# EAGLE design Lighting Schematic (EAGLE 8.7.0)
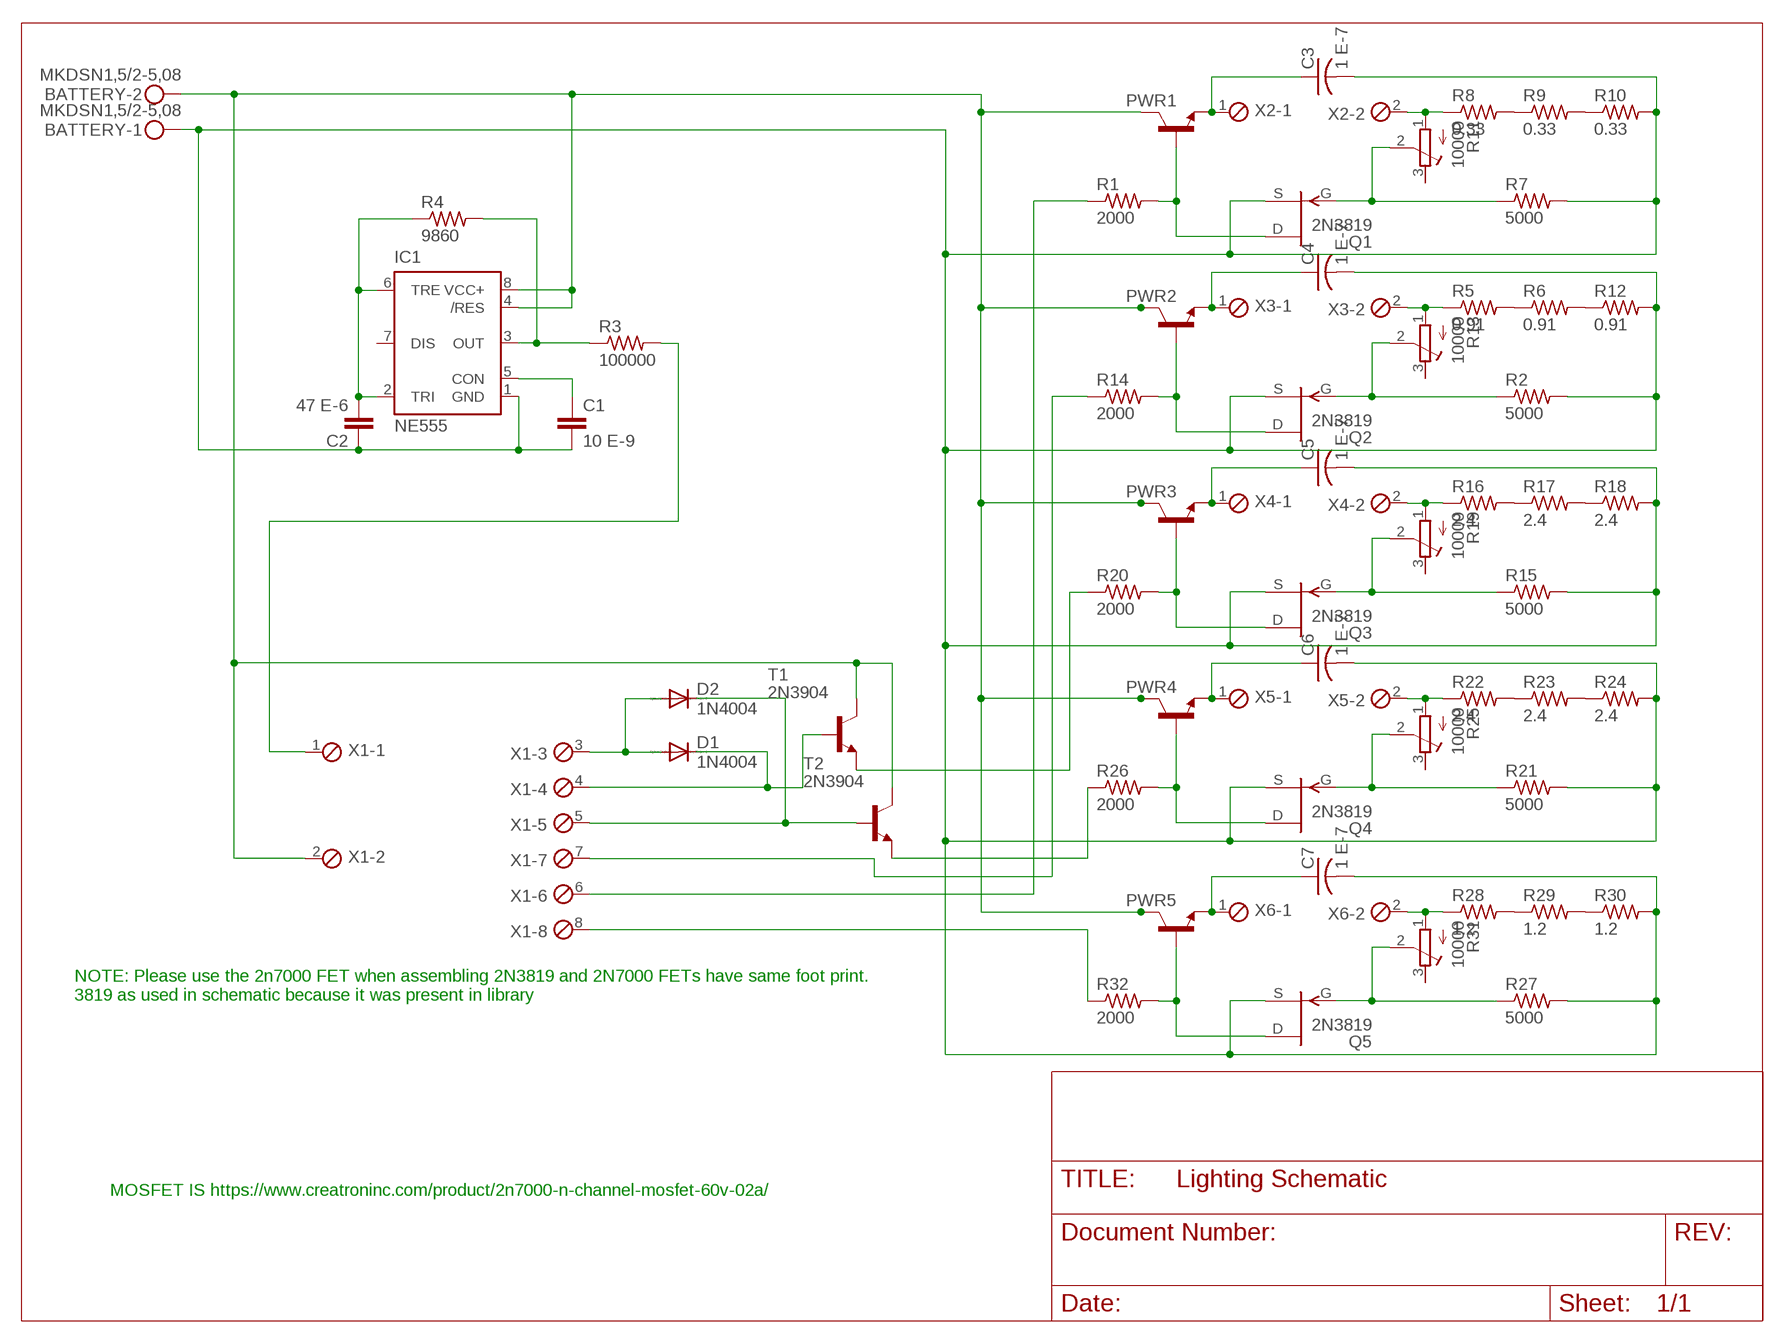
[diagram p0: schematic, sheet 1]

## Parts
BATTERY  MKDSN1,5/2-5,08  [MKDSN1,5/2-5,08]
C1  10 E-9  C2.5/5  [C2.5-5]
C2  47 E-6  C2.5/5  [C2.5-5]
C3  1 E-7  C-US075-052X106  [C075-052X106]
C4  1 E-7  C-US075-052X106  [C075-052X106]
C5  1 E-7  C-US075-052X106  [C075-052X106]
C6  1 E-7  C-US075-052X106  [C075-052X106]
C7  1 E-7  C-US075-052X106  [C075-052X106]
D1  1N4004  [DO41-10]
D2  1N4004  [DO41-10]
IC1  NE555  [DIL-08]
PWR1  -NPN-TO220V  [TO220V]
PWR2  -NPN-TO220V  [TO220V]
PWR3  -NPN-TO220V  [TO220V]
PWR4  -NPN-TO220V  [TO220V]
PWR5  -NPN-TO220V  [TO220V]
Q1  2N3819  [TO92]
Q2  2N3819  [TO92]
Q3  2N3819  [TO92]
Q4  2N3819  [TO92]
Q5  2N3819  [TO92]
R1  2000  R-US_0207/15  [0207/15]
R2  5000  R-US_0207/10  [0207/10]
R3  100000  R-US_0207/10  [0207/10]
R4  9860  R-US_0207/10  [0207/10]
R5  0.91  R-US_0817/7V  [P0817V]
R6  0.91  R-US_0817/7V  [P0817V]
R7  5000  R-US_0207/10  [0207/10]
R8  0.33  R-US_0817/7V  [P0817V]
R9  0.33  R-US_0817/7V  [P0817V]
R10  0.33  R-US_0817/7V  [P0817V]
R11  10000  R-TRIMM3296W  [RTRIM3296W]
R12  0.91  R-US_0817/7V  [P0817V]
R13  10000  R-TRIMM3296W  [RTRIM3296W]
R14  2000  R-US_0207/15  [0207/15]
R15  5000  R-US_0207/10  [0207/10]
R16  2.4  R-US_0817/7V  [P0817V]
R17  2.4  R-US_0817/7V  [P0817V]
R18  2.4  R-US_0817/7V  [P0817V]
R19  10000  R-TRIMM3296W  [RTRIM3296W]
R20  2000  R-US_0207/15  [0207/15]
R21  5000  R-US_0207/10  [0207/10]
R22  2.4  R-US_0817/7V  [P0817V]
R23  2.4  R-US_0817/7V  [P0817V]
R24  2.4  R-US_0817/7V  [P0817V]
R25  10000  R-TRIMM3296W  [RTRIM3296W]
R26  2000  R-US_0207/15  [0207/15]
R27  5000  R-US_0207/10  [0207/10]
R28  1.2  R-US_0817/7V  [P0817V]
R29  1.2  R-US_0817/7V  [P0817V]
R30  1.2  R-US_0817/7V  [P0817V]
R31  10000  R-TRIMM3296W  [RTRIM3296W]
R32  2000  R-US_0207/15  [0207/15]
T1  2N3904  [TO92]
T2  2N3904  [TO92]
X1  MPT8  [8POL254]
X2  MPT2  [2POL254]
X3  MPT2  [2POL254]
X4  MPT2  [2POL254]
X5  MPT2  [2POL254]
X6  MPT2  [2POL254]

## Nets
GND: BATTERY.1 C1.2 C2.1 C3.2 C4.2 C5.2 C6.2 C7.2 IC1.1(GND) Q1.3(S) Q2.3(S) Q3.3(S) Q4.3(S) Q5.3(S) R2.2 R7.2 R10.2 R12.2 R15.2 R18.2 R21.2 R24.2 R27.2 R30.2
HEAD+: C4.1 PWR2.3(E) X3.1
HEAD-: R5.1 R13.1(A) X3.2
HIGH+: C3.1 PWR1.3(E) X2.1
HIGH-: R8.1 R11.1(A) X2.2
LEFT+: C5.1 PWR3.3(E) X4.1
LEFT-: R16.1 R19.1(A) X4.2
N$1: R5.2 R6.1
N$2: C1.1 IC1.5(CON)
N$3: R6.2 R12.1
N$4: C2.2 IC1.2(TRI) IC1.6(TRE) R4.1
N$5: IC1.3(OUT) R3.1 R4.2
N$6: D1.A D2.A X1.3
N$7: D1.C T1.2(B) X1.4
N$8: D2.C T2.2(B) X1.5
N$9: R3.2 X1.1
N$10: R8.2 R9.1
N$11: R9.2 R10.1
N$12: PWR1.1(B) Q1.1(D) R1.2
N$14: Q1.2(G) R7.1 R11.2(S)
N$15: PWR2.1(B) Q2.1(D) R14.2
N$18: Q2.2(G) R2.1 R13.2(S)
N$19: R1.1 X1.6
N$20: R14.1 X1.7
N$21: R26.1 T2.3(E)
N$23: R32.1 X1.8
N$25: R16.2 R17.1
N$26: R17.2 R18.1
N$27: PWR3.1(B) Q3.1(D) R20.2
N$29: Q3.2(G) R15.1 R19.2(S)
N$31: R22.2 R23.1
N$32: R23.2 R24.1
N$33: PWR4.1(B) Q4.1(D) R26.2
N$35: Q4.2(G) R21.1 R25.2(S)
N$37: R28.2 R29.1
N$38: R29.2 R30.1
N$39: PWR5.1(B) Q5.1(D) R32.2
N$41: Q5.2(G) R27.1 R31.2(S)
N$43: R20.1 T1.3(E)
RIGHT+: C6.1 PWR4.3(E) X5.1
RIGHT-: R22.1 R25.1(A) X5.2
TAIL+: C7.1 PWR5.3(E) X6.1
TAIL-: R28.1 R31.1(A) X6.2
VCC: BATTERY.2 IC1.4(/RES) IC1.8(VCC+) PWR1.2(C) PWR2.2(C) PWR3.2(C) PWR4.2(C) PWR5.2(C) T1.1(C) T2.1(C) X1.2
Unconnected: IC1.7(DIS) R11.3(E) R13.3(E) R19.3(E) R25.3(E) R31.3(E)

## Notes on the sheet
- NOTE: Please use the 2n7000 FET when assembling 2N3819 and 2N7000 FETs have same foot print.
  3819 as used in schematic because it was present in library
- MOSFET IS https://www.creatroninc.com/product/2n7000-n-channel-mosfet-60v-02a/

## Library data of the parts
BATTERY = con-phoenix-508:MKDSN1,5/2-5,08: MKDSN 1,5/ 2-5,08 Printklemme Nennstrom: 13,5 A Nennspannung: 250 V Rastermaß: 5,08 mm Polzahl: 2 Anschlussart: Schraubanschluss Montage: Löten Anschlussrichtung Leiter/Platine: 0 ° Artikelnummer: 1729128 Source: http://eshop.phoenixcontact.com .. 1729128.pdf
C1 C2 = capacitor-wima:C: CAPACITOR naming: grid - package width
C3-C7 = resistor:C-US: CAPACITOR, American symbol
D1 D2 = diode:1N4004: DIODE general purpose rectifier, 1 A
IC1 = st-microelectronics:NE555: General purpose bipolar Timer; MF: Arrow Electronics; MPN: NE555N; OC_FARNELL: 1467742; OC_NEWARK: 89K1486
PWR1-PWR5 = transistor:*-NPN-: NPN Transistror BF959 corrected 2008.03.06
Q1-Q5 = transistor-fet:2N3819: N-Channel Junction FET
R1 R14 R20 R26 R32 = resistor:R-US_: RESISTOR, American symbol
R2-R10 R12 R15-R18 R21-R24 R27-R30 = rcl:R-US_: RESISTOR, American symbol; SPICEPREFIX: R
R11 R13 R19 R25 R31 = rcl:R-TRIMM: Trimm resistor; SPICEMODEL: X; SPICEPREFIXL: POT
T1 T2 = transistor:2N3904: NPN TRANSISTOR
X1 = con-phoenix-254:MPT8: PHOENIX CONNECTOR; OC_FARNELL: unknown; OC_NEWARK: unknown
X2-X6 = con-phoenix-254:MPT2: PHOENIX CONNECTOR; OC_FARNELL: unknown; OC_NEWARK: unknown

## Board
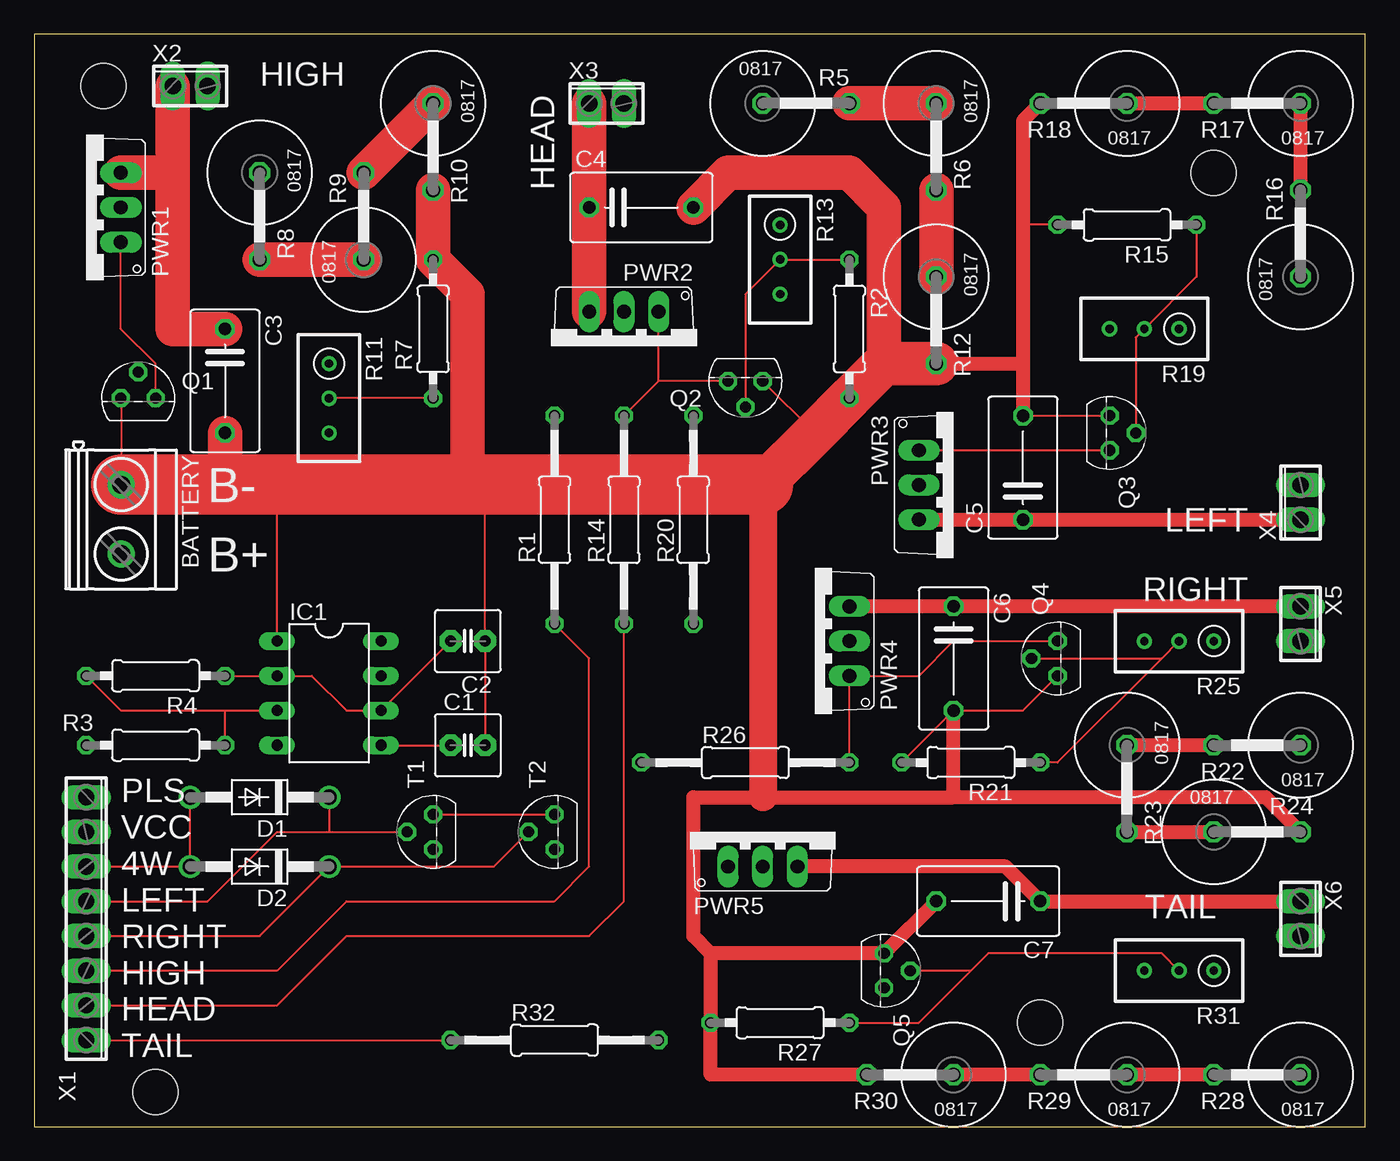
[diagram p1: board, top side]
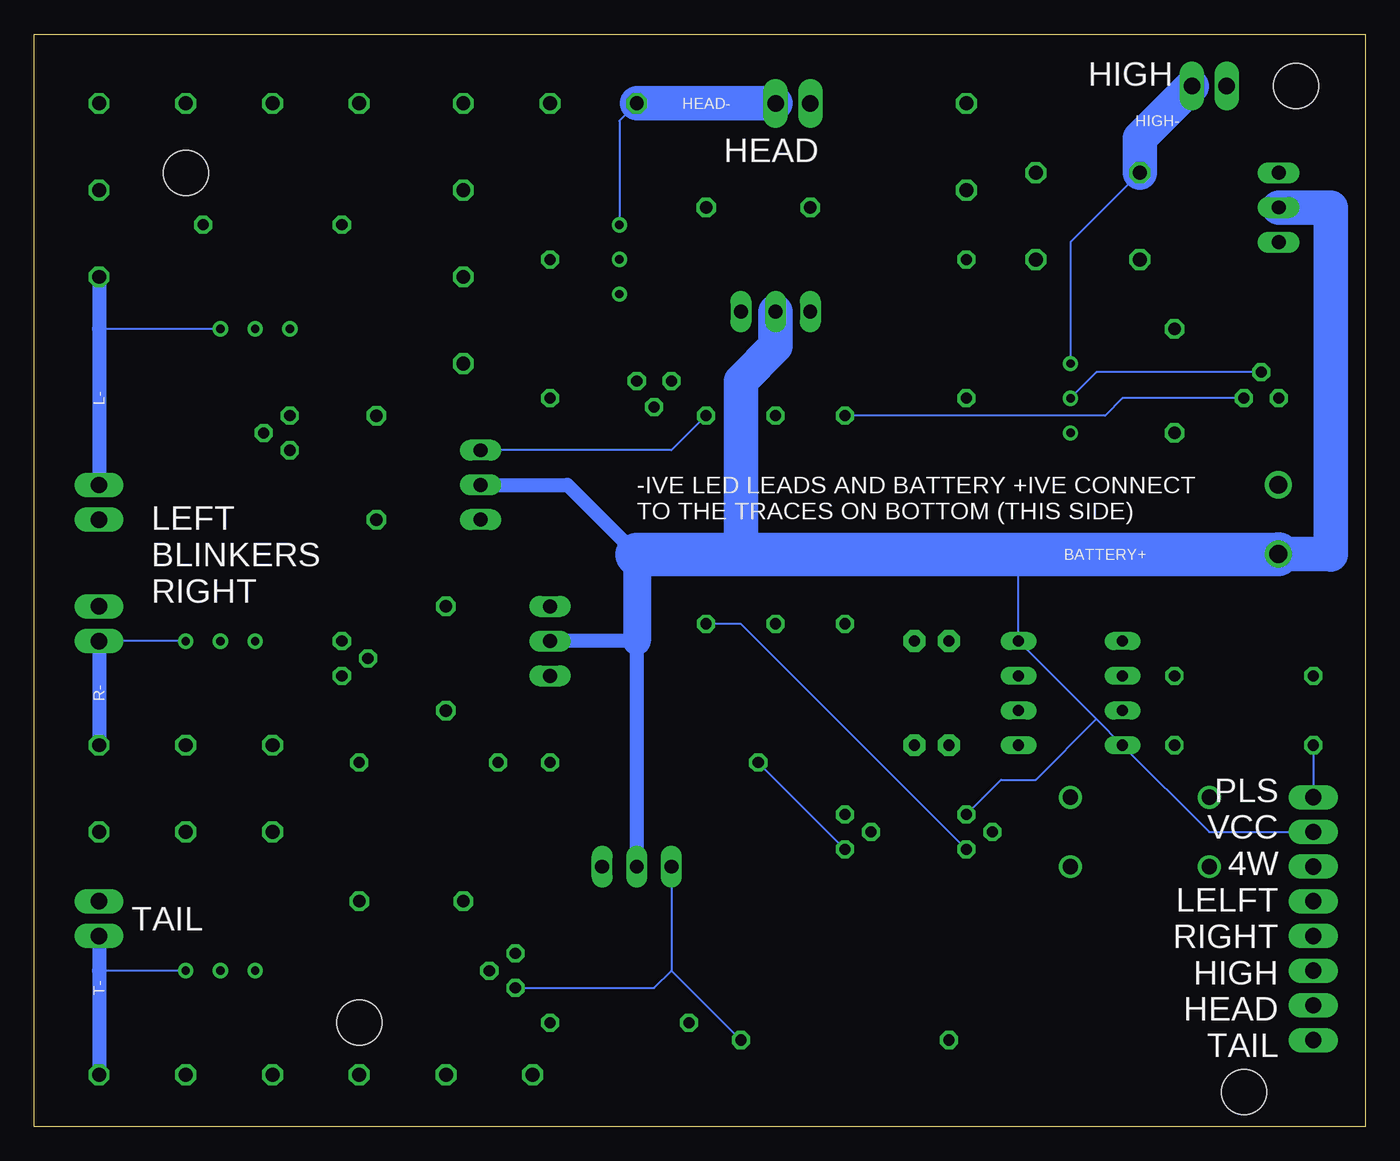
[diagram p2: board, bottom side, seen from below]

Size 97.46 x 80 mm. Coordinates in mm from the lower left corner, seen from the top.
Outline: 0,0 97.46,0 97.46,80 0,80 0,0
Copper layers (1*16): Top 0.035mm / dielectric 1.5mm / Bottom 0.035mm
Design rules "default": minimum track width 6mil, minimum drill 0.35mm, track to track 6mil, track to pad 6mil, pad to pad 6mil, via to via 6mil, smd to smd 6mil, copper to edge 40mil, drill to drill 6mil, minimum pad ring 10mil, minimum via ring 8mil, stop-mask expansion 4mil, vias tented up to drill 0mil, thermal gap 10mil
Holes 3.3 mm at 5.08,76.2 73.66,7.62 8.89,2.54 86.36,69.85

### Footprints (pad centres in the part's own frame; a part is rotated, then mirrored left to right if it is on the bottom)
MKDSN1,5/2-5,08 = drill 1.3 pad 2: 1 -2.561,0.025; 2 2.519,0.025
C2.5-5 = drill 0.813 pad 1.6 octagon: 1 -1.27,0; 2 1.27,0
C075-052X106 = drill 0.914 octagon: 1 -3.81,0; 2 3.81,0
DO41-10 = drill 1.118: A 5.08,0; C -5.08,0
DIL-08 = drill 0.813 long: 1 -3.81,-3.81; 2 -1.27,-3.81; 3 1.27,-3.81; 4 3.81,-3.81; 5 3.81,3.81; 6 1.27,3.81; 7 -1.27,3.81; 8 -3.81,3.81
TO220V = drill 1.016 long: 1 -2.54,-2.54; 2 0,-2.54; 3 2.54,-2.54
TO92 = drill 0.813 octagon: 1 1.27,0; 2 0,1.905; 3 -1.27,0
0207/15 = drill 0.813 octagon: 1 -7.62,0; 2 7.62,0
0207/10 = drill 0.813 octagon: 1 -5.08,0; 2 5.08,0
P0817V = drill 1.016 octagon: 1 -5.08,0; 2 1.27,0
RTRIM3296W = drill 0.61: 1 0,-2.54; 2 0,0; 3 0,2.54
8POL254 = drill 1.2 long: 1 -8.89,0; 2 -6.35,0; 3 -3.81,0; 4 -1.27,0; 5 1.27,0; 6 3.81,0; 7 6.35,0; 8 8.89,0
2POL254 = drill 1.2 long: 1 -1.27,0; 2 1.27,0

### Placement (x,y rotation side)
BATTERY  6.35,44.45 270 top
C1  31.75,27.94 0 top
C2  31.75,35.56 180 top
C3  13.97,54.61 270 top
C4  44.45,67.31 0 top
C5  72.39,48.26 90 top
C6  67.31,34.29 270 top
C7  69.85,16.51 180 top
D1  16.51,24.13 180 top
D2  16.51,19.05 180 top
IC1  21.59,31.75 270 top
PWR1  3.81,67.31 90 top
PWR2  43.18,57.15 180 top
PWR3  67.31,46.99 270 top
PWR4  57.15,35.56 90 top
PWR5  53.34,21.59 0 top
Q1  7.62,53.34 0 top
Q2  52.07,54.61 180 top
Q3  78.74,50.8 270 top
Q4  74.93,34.29 90 top
Q5  62.23,11.43 270 top
R1  38.1,44.45 90 top
R2  59.69,58.42 270 top
R3  8.89,27.94 180 top
R4  8.89,33.02 180 top
R5  58.42,74.93 0 top
R6  66.04,69.85 270 top
R7  29.21,58.42 90 top
R8  16.51,64.77 270 top
R9  24.13,68.58 90 top
R10  29.21,69.85 270 top
R11  21.59,53.34 180 top
R12  66.04,57.15 270 top
R13  54.61,63.5 180 top
R14  43.18,44.45 90 top
R15  80.01,66.04 180 top
R16  92.71,67.31 90 top
R17  87.63,74.93 180 top
R18  74.93,74.93 180 top
R19  81.28,58.42 90 top
R20  48.26,44.45 90 top
R21  68.58,26.67 180 top
R22  87.63,27.94 180 top
R23  80.01,22.86 270 top
R24  91.44,21.59 0 top
R25  83.82,35.56 90 top
R26  52.07,26.67 0 top
R27  54.61,7.62 180 top
R28  87.63,3.81 180 top
R29  74.93,3.81 180 top
R30  62.23,3.81 180 top
R31  83.82,11.43 90 top
R32  38.1,6.35 0 top
T1  29.21,21.59 90 top
T2  38.1,21.59 90 top
X1  3.81,15.24 270 top
X2  11.43,76.2 0 top
X3  41.91,74.93 0 top
X4  92.71,45.72 90 top
X5  92.71,36.83 270 top
X6  92.71,15.24 270 top

### Tracks (layer width: path | path; a pad name or v marks a point on that pad's centre or on a via)
GND
  Top 0.152: Q1.3 6.38,53.31 BATTERY.1 | Q2.3 57.15,50.8 | R15.2 72.39,66.04 | C5.2 Q3.3 | Q4.3 72.39,30.48 C6.2 R21.2 | IC1.1 17.78,47.01 | C1.2 C2.1 33.02,45.74 31.75,47.01
  Top 1.016: R18.2 72.39,73.66 72.39,66.04 72.39,55.88 | 72.39,55.88 C5.2 | R12.2 72.39,55.88 | R24.2 90.17,24.13 67.31,24.13 | 67.31,24.13 C6.2 | R30.2 49.53,3.81 R27.2 49.53,12.7 | C7.2 Q5.3 49.53,12.7 | 49.53,12.7 48.26,13.97 48.26,24.13 53.34,24.13 67.31,24.13
  Top 2.032: 53.36,47.01 53.36,24.15 53.34,24.13
  Top 2.54: C3.2 13.97,47.01 | R10.2 R7.2 31.75,60.96 31.75,47.01 | C4.2 50.8,69.85 59.69,69.85 62.23,67.31 62.23,55.88
  Top 3.175: R12.2 62.23,55.88 R2.2 57.15,50.8 53.36,47.01
  Top 4.445: BATTERY.1 13.97,47.01 17.78,47.01 31.75,47.01 48.26,47.01 53.36,47.01
HEAD+
  Top 2.54: X3.1 C4.1 PWR2.3
HEAD-
  Bottom 0.152: R5.1 54.61,73.66 R13.1
  Bottom 2.54: X3.2 R5.1
HIGH+
  Top 2.54: C3.1 10.16,58.42 10.16,69.85 | 10.16,69.85 X2.1 | PWR1.3 10.16,69.85
HIGH-
  Bottom 0.152: R8.1 21.59,64.77 R11.1
  Bottom 2.54: X2.2 16.51,72.39 R8.1
LEFT+
  Top 1.016: X4.1 C5.1 PWR3.3
LEFT-
  Bottom 0.152: R19.1 92.71,58.42
  Bottom 1.016: R16.1 92.71,58.42 X4.2
N$1
  Top 2.54: R5.2 R6.1
N$2
  Top 0.152: IC1.5 C1.1
N$3
  Top 2.54: R6.2 R12.1
N$4
  Top 0.152: C2.2 IC1.6 22.86,30.48 20.32,33.02 IC1.2 R4.1
N$5
  Top 0.152: R3.1 13.97,30.48 | 13.97,30.48 IC1.3 | R4.2 6.35,30.48 13.97,30.48
N$6
  Top 0.152: X1.3 D2.A D1.A
N$7
  Top 0.152: X1.4 12.7,16.51 17.78,21.59 21.59,21.59 | 21.59,21.59 T1.2 | D1.C 21.59,21.59
N$8
  Top 0.152: X1.5 16.51,13.97 D2.C 33.66,19.05 T2.2
N$9
  Bottom 0.152: R3.2 X1.1
N$10
  Top 2.54: R8.2 R9.1
N$11
  Top 2.54: R9.2 R10.1
N$12
  Top 0.152: Q1.1 8.89,55.88 6.35,58.42 PWR1.1
  Bottom 0.152: Q1.1 17.78,53.34 19.05,52.07 R1.2
N$14
  Top 0.152: R7.1 R11.2
  Bottom 0.152: Q1.2 19.68,55.24 R11.2
N$15
  Top 0.152: R14.2 45.72,54.61 | 45.72,54.61 PWR2.1 | Q2.1 45.72,54.61
N$18
  Top 0.152: R2.1 R13.2 52.07,60.96 Q2.2
N$19
  Top 0.152: R1.1 40.64,34.29 40.64,19.05 38.1,16.51 22.86,16.51 17.78,11.43 X1.6
N$20
  Top 0.152: X1.7 17.78,8.89 22.86,13.97 40.64,13.97 43.18,16.51 R14.1
N$21
  Bottom 0.152: T2.3 R26.1
N$23
  Top 0.152: X1.8 R32.1
N$25
  Top 1.016: R17.1 R16.2
N$26
  Top 1.016: R18.1 R17.2
N$27
  Top 0.152: PWR3.1 Q3.1
  Bottom 0.152: R20.2 50.8,49.53 PWR3.1
N$29
  Top 0.152: R15.1 85.09,62.23 R19.2 80.64,57.78 Q3.2
N$31
  Top 1.016: R22.2 R23.1
N$32
  Top 1.016: R23.2 R24.1
N$33
  Top 0.152: R26.2 PWR4.1 64.77,33.02 67.31,35.56 Q4.1
N$35
  Top 0.152: R25.2 82.55,34.29 | 82.55,34.29 74.93,26.67 R21.1 | Q4.2 82.55,34.29
N$37
  Top 1.016: R28.2 R29.1
N$38
  Top 1.016: R29.2 R30.1
N$39
  Bottom 0.152: Q5.1 52.07,10.16 50.8,11.43 | 50.8,11.43 R32.2 | PWR5.1 50.8,11.43
N$41
  Top 0.152: 68.58,11.43 Q5.2 | R31.2 82.55,12.7 69.85,12.7 68.58,11.43 | R27.1 64.77,7.62 68.58,11.43
N$43
  Bottom 0.152: T1.3 45.72,36.83 R20.1
RIGHT+
  Top 1.016: X5.1 C6.1 PWR4.3
RIGHT-
  Bottom 0.152: R25.1 X5.2
  Bottom 1.016: X5.2 R22.1
TAIL+
  Top 1.016: X6.1 C7.1 71.12,19.05 PWR5.3
TAIL-
  Bottom 0.152: R31.1 92.71,11.43
  Bottom 1.016: X6.2 92.71,11.43 R28.1
VCC
  Top 0.152: T1.1 T2.1
  Bottom 0.152: 25.4,41.91 IC1.8 19.68,29.84 | 19.68,29.84 IC1.4 11.43,21.59 X1.2 | T1.1 26.67,25.4 24.13,25.4 19.68,29.84
  Bottom 1.016: PWR5.2 53.34,35.56 PWR4.2 | PWR3.2 58.42,46.99 53.34,41.91
  Bottom 2.032: 53.34,41.91 53.34,35.56
  Bottom 2.54: PWR1.2 2.54,67.31 2.54,41.91 2.56,41.93 BATTERY.2 | PWR2.2 43.18,57.15 45.72,54.61 45.72,41.91
  Bottom 3.175: BATTERY.2 6.4,41.91 25.4,41.91 45.72,41.91 53.34,41.91

### Text on the board
tNames: HIGH | HEAD | B- | LEFT | B+ | RIGHT | TAIL | PLS / VCC / 4W / LEFT / RIGHT / HIGH / HEAD / TAIL
bNames: HIGH | HEAD- | HIGH- | HEAD | L- | -IVE LED LEADS AND BATTERY +IVE CONNECT / TO THE TRACES ON BOTTOM (THIS SIDE) | BATTERY+ | LEFT / BLINKERS / RIGHT | R- | TAIL | T- | PLS / VCC / 4W / LELFT / RIGHT / HIGH / HEAD / TAIL